# EAGLE design HC-BME280_revA (EAGLE 7.3.0)
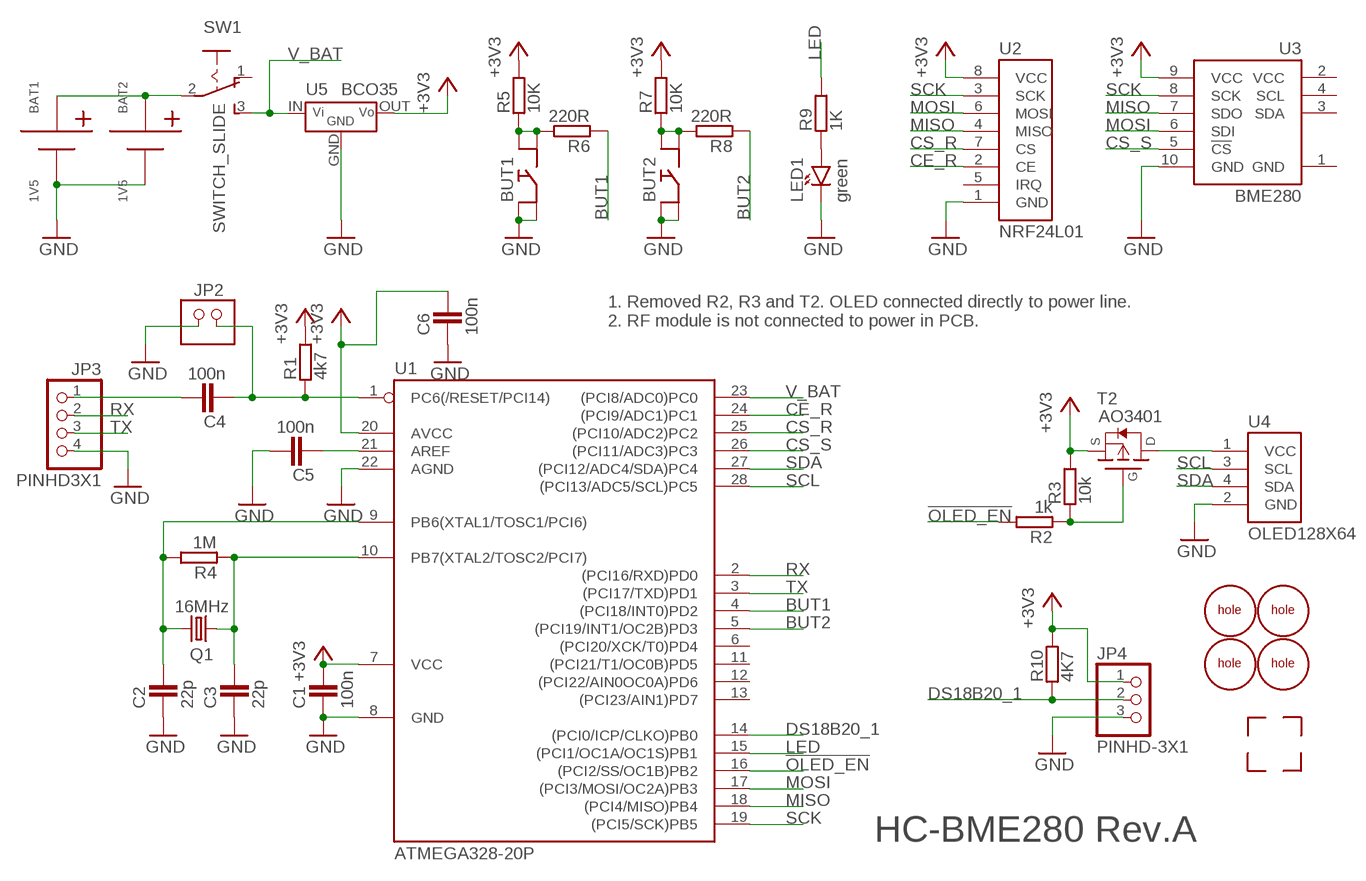
[diagram p0: schematic, sheet 1]

## Parts
BAT1  1V5  BATTERY_1X  [1XAA_BATTERY_HOLDER]
BAT2  1V5  BATTERY_1X  [1XAA_BATTERY_HOLDER]
BUT1  BUTTON'THT'  [BUTTON]
BUT2  BUTTON'THT'  [BUTTON]
C1  100n  C-CERAMIC'SMD'  [C0805]
C2  22p  C-CERAMIC'SMD'  [C0805]
C3  22p  C-CERAMIC'SMD'  [C0805]
C4  100n  C-CERAMIC'SMD'  [C0805]
C5  100n  C-CERAMIC'SMD'  [C0805]
C6  100n  C-CERAMIC'SMD'  [C0805]
JP2  PINHD2X1  PINHD-2X1  [PINHD-2X1]
JP3  PINHD3X1  PINHD-4X1  [PINHD-4X1-90]
JP4  PINHD-3X1  [PINHD-3X1]
LED1  green  LED'SMD'  [LED0805]
Q1  16MHz  CRYSTALHC49S  [HC49/S]
R1  4k7  R'2'  [R0805]
R2  1k  R'2'  [R0805]
R3  10k  R'2'  [R0805]
R4  1M  R'2'  [R0805]
R5  10K  R'2'  [R0805]
R6  220R  R'2'  [R0805]
R7  10K  R'2'  [R0805]
R8  220R  R'2'  [R0805]
R9  1K  R'2'  [R0805]
R10  4K7  R'2'  [R0805]
SW1  SWITCH_SLIDE  [SLIDE_SWITCH]
T2  AO3401  [SOT23]
U1  ATMEGA328-20P  [DIL28-3]
U2  NRF24L01  [NRF24L01]
U3  BME280  [BME280]
U4  OLED128X64  [OLED128X64]
U5  BCO35  STEP_UP-BCO35  [BCO35]
U$1  CORNER  [CORNER]
U$2  CORNER  [CORNER]
U$3  CORNER  [CORNER]
U$4  CORNER  [CORNER]
U$5  HOLE  [HOLE]
U$6  HOLE  [HOLE]
U$7  HOLE  [HOLE]
U$8  HOLE  [HOLE]

## Nets
!OLED_EN: R2.2 U1.16((PCI2/SS/OC1B)PB2)
+3V3: C1.2 C6.2 JP4.1 R1.2 R3.2 R5.2 R7.2 R10.2 T2.2(S) U1.7(VCC) U1.20(AVCC) U2.8(VCC) U3.9(VCC) U5.OUT(VOUT)
BUT1: R6.1 U1.4((PCI18/INT0)PD2)
BUT2: R8.1 U1.5((PCI19/INT1/OC2B)PD3)
CE_R: U1.24((PCI9/ADC1)PC1) U2.2(CE)
CS_R: U1.25((PCI10/ADC2)PC2) U2.7(CS)
CS_S: U1.26((PCI11/ADC3)PC3) U3.5(!CS)
DS18B20_1: JP4.2 R10.1 U1.14((PCI0/ICP/CLKO)PB0)
GND: BAT1.N BAT2.N BUT1.2 BUT1.4 BUT2.2 BUT2.4 C1.1 C2.1 C3.1 C5.2 C6.1 JP2.1 JP3.4 JP4.3 LED1.2(K) U1.8(GND) U1.22(AGND) U2.1(GND) U3.10(GND) U4.2(GND) U5.GND
LED: R9.2 U1.15((PCI1/OC1A/OC1S)PB1)
MISO: U1.18((PCI4/MISO)PB4) U2.4(MISO) U3.7(SDO)
MOSI: U1.17((PCI3/MOSI/OC2A)PB3) U2.6(MOSI) U3.6(SDI)
N$1: C3.2 Q1.1 R4.1 U1.10(PB7(XTAL2/TOSC2/PCI7))
N$2: C4.1 JP2.2 R1.1 U1.1(PC6(/RESET/PCI14))
N$3: R2.1 R3.1 T2.1(G)
N$4: C2.2 Q1.2 R4.2 U1.9(PB6(XTAL1/TOSC1/PCI6))
N$5: C5.1 U1.21(AREF)
N$6: C4.2 JP3.1
N$7: T2.3(D) U4.1(VCC)
N$8: BAT1.P BAT2.P SW1.2(MIDDLE)
N$9: BUT1.1 BUT1.3 R5.1 R6.2
N$10: BUT2.1 BUT2.3 R7.1 R8.2
N$11: LED1.1(A) R9.1
RX: JP3.2 U1.2((PCI16/RXD)PD0)
SCK: U1.19((PCI5/SCK)PB5) U2.3(SCK) U3.8(SCK)
SCL: U1.28((PCI13/ADC5/SCL)PC5) U4.3(SCL)
SDA: U1.27((PCI12/ADC4/SDA)PC4) U4.4(SDA)
TX: JP3.3 U1.3((PCI17/TXD)PD1)
V_BAT: SW1.3(S) U1.23((PCI8/ADC0)PC0) U5.IN(VIN)
Unconnected: SW1.1(O) U1.6((PCI20/XCK/T0)PD4) U1.11((PCI21/T1/OC0B)PD5) U1.12((PCI22/AIN0OC0A)PD6) U1.13((PCI23/AIN1)PD7) U2.5(IRQ) U3.3(SDA) U3.4(SCL)

## Notes on the sheet
- 1. Removed R2, R3 and T2. OLED connected directly to power line.
  2. RF module is not connected to power in PCB.
- HC-BME280 Rev.A

## Power pins joined to a net without a drawn wire
GND: U3.1(GND)
VCC: U3.2(VCC)

## Library data of the parts
BAT1 BAT2 = 1_domaci:BATTERY_1X
BUT1 BUT2 = 1_domaci:BUTTON
C1-C6 = 1_domaci:C-CERAMIC
JP2 = 1_domaci:PINHD-2X1
JP3 = 1_domaci:PINHD-4X1: PIN HEADER
JP4 = 1_domaci:PINHD-3X1
LED1 = 1_domaci:LED
Q1 = crystal:CRYSTAL: CRYSTAL; OC_FARNELL: 1667008; OC_NEWARK: unknown
R1-R10 = 1_domaci:R
SW1 = 1_domaci:SWITCH_SLIDE
T2 = 1_domaci:AO3401
U1 = 1_domaci:ATMEGA328*P: MICROCONTROLLER 32 kBytes FLASH 2 kBytes SRAM 1 kBytes EEPROM USART 8-channel 10 bit ADC
U2 = 1_domaci:NRF24L01
U3 = 1_domaci:BME280
U4 = 1_domaci:OLED128X64
U5 = 1_domaci:STEP_UP-BCO35
U$1-U$4 = 1_domaci:CORNER
U$5-U$8 = 1_domaci:HOLE

## Board
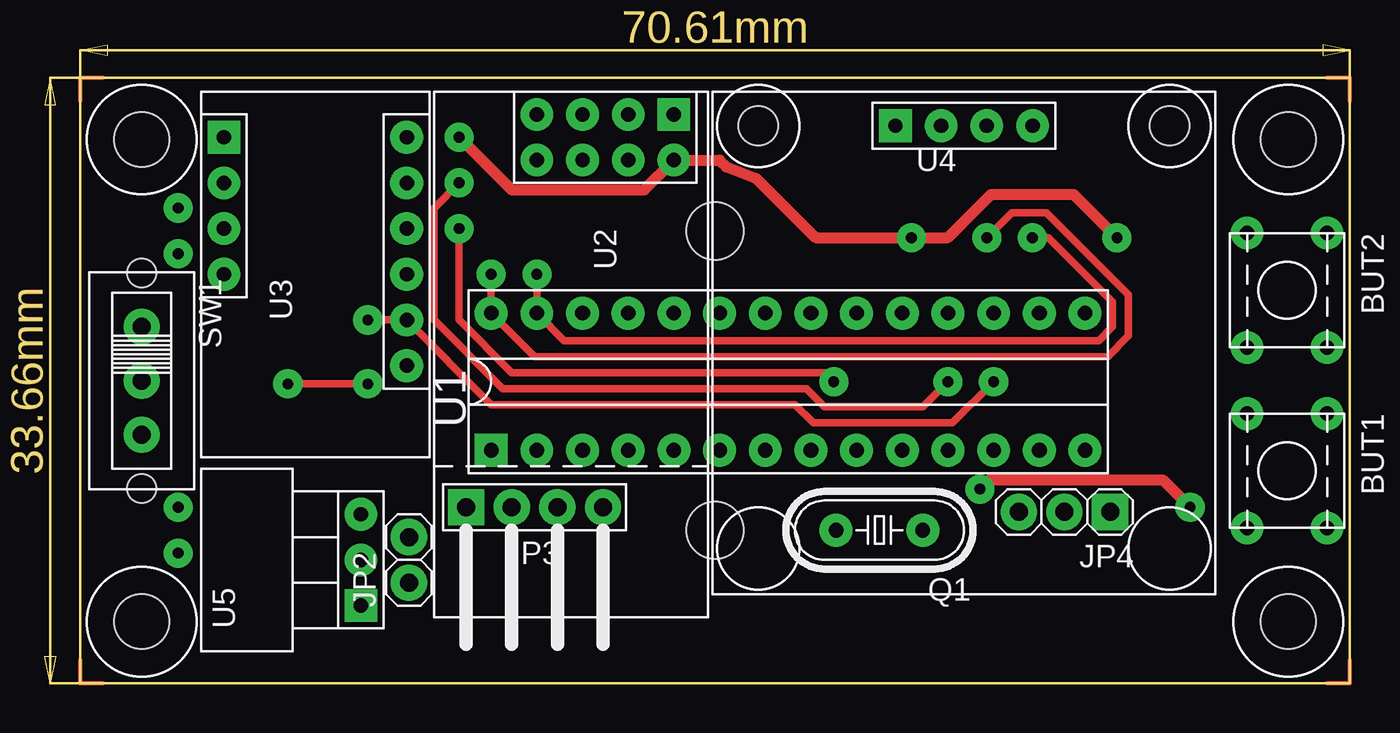
[diagram p1: board, top side]
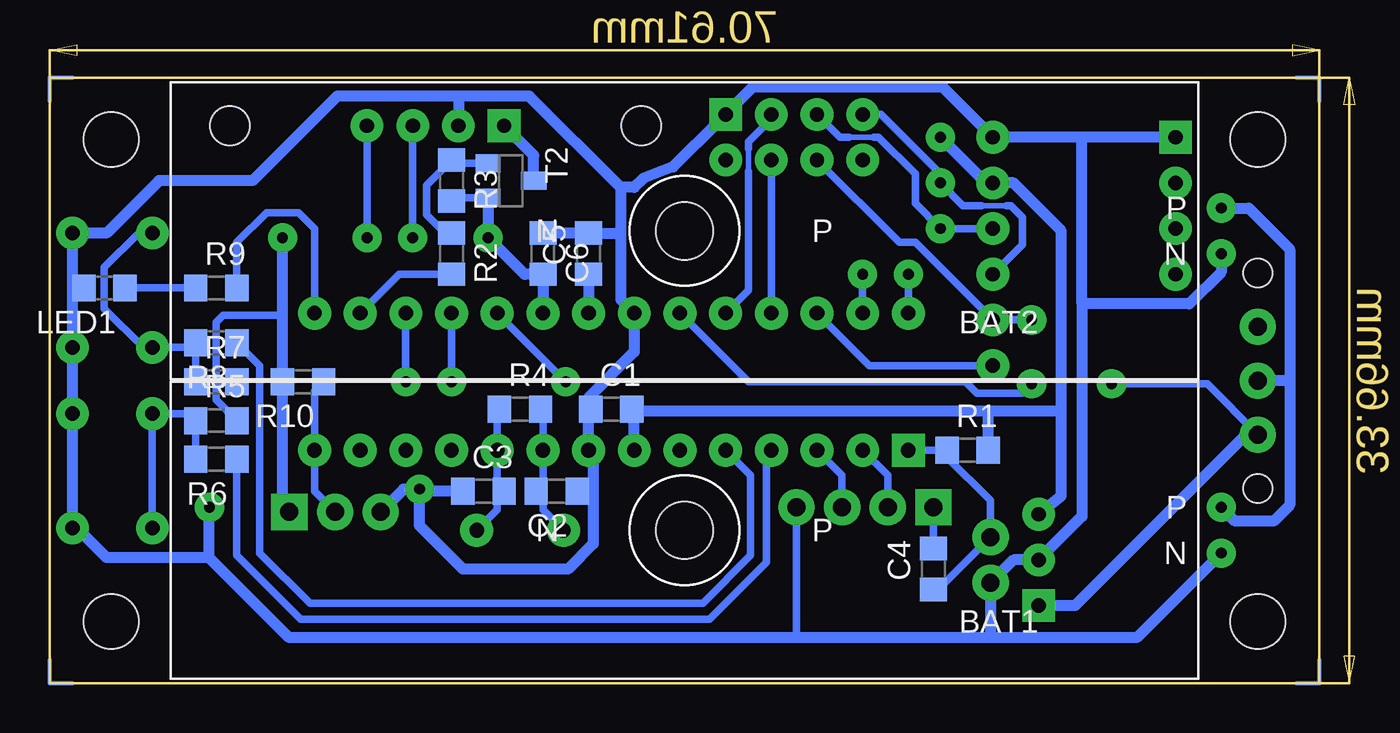
[diagram p2: board, bottom side, seen from below]

Size 70.61 x 33.66 mm. Coordinates in mm from the lower left corner, seen from the top.
Outline: 0,33.66 70.61,33.66 70.61,0 0,0 0,33.66
Copper layers (1*16): Top 0.035mm / dielectric 1.5mm / Bottom 0.035mm
Design rules "default *": minimum track width 10mil, minimum drill 24mil, track to track 8mil, track to pad 8mil, pad to pad 8mil, via to via 8mil, smd to smd 8mil, copper to edge 40mil, drill to drill 8mil, minimum pad ring 20mil, minimum via ring 20mil, stop-mask expansion 4mil, vias tented up to drill 0mil, thermal gap 10mil

### Footprints (pad centres in the part's own frame; a part is rotated, then mirrored left to right if it is on the bottom)
1XAA_BATTERY_HOLDER = drill 0.6: N -29.845,1.27; P -29.845,-1.27 | hole 3.2: 0,0
BUTTON = drill 0.8 pad 1.676: 1 -2.54,-2.54; 2 -2.54,1.905; 3 3.81,-2.54; 4 3.81,1.905
C0805 = smd 1.3 x 1.5: 1 -1.143,0; 2 1.143,0
PINHD-2X1 = drill 1 pad 1.676: 1 -1.27,0; 2 1.27,0
PINHD-4X1-90 = drill 1 pad 1.854 square: 1 3.81,0 | drill 1 pad 1.854: 2 1.27,0; 3 -1.27,0; 4 -3.81,0
PINHD-3X1 = drill 1 pad 1.676 square: 1 -2.54,0 | drill 1 pad 1.676: 2 0,0; 3 2.54,0
LED0805 = smd 1.3 x 1.5: 1 -1.143,0; 2 1.143,0
HC49/S = drill 0.813: 1 -2.413,0; 2 2.413,0
R0805 = smd 1.3 x 1.5: 1 -1.143,0; 2 1.143,0
SLIDE_SWITCH = drill 1 pad 1.93: 1 -2.921,0; 2 0.076,0; 3 3.073,0 | hole 1.6: 6.071,0; -5.918,0
SOT23 = smd 1 x 1.4: 1 -0.953,-1.27; 2 0.953,-1.27; 3 0,1.27
DIL28-3 = drill 0.813 square: 1 -16.51,-3.81 | drill 0.813: 2 -13.97,-3.81; 3 -11.43,-3.81; 4 -8.89,-3.81; 5 -6.35,-3.81; 6 -3.81,-3.81; 7 -1.27,-3.81; 8 1.27,-3.81; 9 3.81,-3.81; 10 6.35,-3.81; 11 8.89,-3.81; 12 11.43,-3.81; 13 13.97,-3.81; 14 16.51,-3.81; 15 16.51,3.81; 16 13.97,3.81; 17 11.43,3.81; 18 8.89,3.81; 19 6.35,3.81; 20 3.81,3.81; 21 1.27,3.81; 22 -1.27,3.81; 23 -3.81,3.81; 24 -6.35,3.81; 25 -8.89,3.81; 26 -11.43,3.81; 27 -13.97,3.81; 28 -16.51,3.81
NRF24L01 = drill 0.8 square: 1 -1.27,5.08 | drill 0.8: 2 -1.27,2.54; 3 -1.27,0; 4 -1.27,-2.54; 5 1.27,-2.54; 6 1.27,0; 7 1.27,2.54; 8 1.27,5.08
BME280 = drill 0.8 square: 1 -5.08,7.62 | drill 0.8: 2 -5.08,5.08; 3 -5.08,2.54; 4 -5.08,0; 5 5.08,-5.08; 6 5.08,-2.54; 7 5.08,0; 8 5.08,2.54; 9 5.08,5.08; 10 5.08,7.62
OLED128X64 = drill 0.8 square: 1 -3.81,0 | drill 0.8: 2 -1.27,0; 3 1.27,0; 4 3.81,0 | hole 2.2: -11.43,0; 11.43,0
BCO35 = drill 0.8: GND 0,0; OUT 2.54,0 | drill 0.8 square: IN -2.54,0
HOLE = hole 3.048: 0,0

### Placement (x,y rotation side)
BAT1  35.31,8.51 180 bottom
BAT2  35.31,25.15 180 bottom
BUT1  67.44,12.45 270 top
BUT2  67.44,22.48 270 top
C1  39.37,15.24 0 bottom
C2  42.42,10.67 180 bottom
C3  46.48,10.67 0 bottom
C4  21.46,6.35 90 bottom
C5  40.64,23.88 90 bottom
C6  43.18,23.88 270 bottom
JP2  18.29,6.86 90 top
JP3  25.27,9.78 180 top
JP4  54.74,9.53 180 top
LED1  67.56,21.97 180 bottom
Q1  44.45,8.51 180 top
R1  19.56,12.95 0 bottom
R2  48.26,23.88 270 bottom
R3  48.26,27.94 270 bottom
R4  44.45,15.24 0 bottom
R5  61.34,14.61 0 bottom
R6  61.34,12.45 180 bottom
R7  61.34,16.76 0 bottom
R8  61.34,18.92 180 bottom
R9  61.34,21.97 0 bottom
R10  56.52,16.76 180 bottom
SW1  3.43,16.89 270 top
T2  44.96,27.94 270 bottom
U1  39.37,16.76 0 top
U2  27.94,30.35 270 top
U3  13.08,22.73 0 top
U4  49.15,30.99 0 top
U5  15.62,6.86 90 top
U$1  69.98,33.02 180 top
U$2  0.64,0.64 0 top
U$3  0.64,33.02 270 top
U$4  69.98,0.64 90 top
U$5  67.18,3.43 90 top
U$6  67.18,30.23 90 top
U$7  3.43,30.23 90 top
U$8  3.43,3.43 90 top

### Tracks (layer width: path | path; a pad name or v marks a point on that pad's centre or on a via)
!OLED_EN
  Bottom 0.406: U1.16 51.18,22.73 R2.2
+3V3  (via drill 0.6)
  Top 0.61: v57.66,24.77 55.24,27.18 50.67,27.18 48.26,24.77 v46.23,24.77 40.89,24.77 37.59,28.07 35.94,28.7 35.56,29.08 U2.8 31.37,27.43 24,27.43 v21.08,30.35
  Bottom 0.406: 61.34,16.76 61.34,15.75 R5.2 | R7.2 61.34,16.76 | T2.2 48.07,26.99 R3.2 | 61.34,16.76 61.34,20.07 60.96,20.45 57.66,20.45
  Bottom 0.61: U1.20 C6.2 44.2,22.73 v46.23,24.77 T2.2 | JP4.1 57.66,9.91 R10.2 57.66,20.45 v57.66,24.77 | U1.7 38.1,15.11 | v21.08,30.35 18.54,27.81 U3.9 17.02,27.81 14.35,25.15 14.35,15.11 | 14.35,15.11 18.41,15.11 | 18.41,15.11 38.1,15.11 | 38.1,15.11 C1.2 | R1.2 18.41,15.11 | U5.OUT 14.35,10.41 14.35,15.11
BUT1
  Bottom 0.406: U1.4 30.73,12.7 30.73,6.73 33.91,3.56 56.64,3.56 60.2,7.11 R6.1 60.2,12.06
BUT2
  Bottom 0.406: U1.5 31.62,11.56 31.62,7.11 34.29,4.45 56.13,4.45 58.93,7.24 58.93,17.65 R8.1
CE_R
  Bottom 0.305: 31.75,29.72 31.75,28.45
  Bottom 0.406: U2.2 30.48,31.37 31.75,30.1 31.75,29.72 | U1.24 31.75,21.84 31.75,28.45
CS_R
  Bottom 0.406: U2.7 U1.25
CS_S
  Bottom 0.406: U1.26 25.02,17.65 U3.5 18.03,17.65
DS18B20_1
  Bottom 0.406: R10.1 55.88,16.26 U1.14 55.88,10.67 JP4.2
GND  (via drill 0.6)
  Top 0.61: v50.04,10.79 50.55,11.3 60.2,11.3 v61.72,9.78
  Bottom 0.406: LED1.2 69.34,21.97 | C2.1 40.39,10.67 | JP3.4 29.08,2.54
  Bottom 0.61: 38.86,27.56 38.1,27.56 37.59,28.07 35.94,28.7 33.4,31.24 33.4,31.62 U2.1 31.5,33.15 20.95,33.15 U3.10 13.21,30.35 | 38.86,27.56 43.94,32.64 47.88,32.64 | 47.88,32.64 U4.2 | 47.88,32.64 54.61,32.64 59.31,27.94 64.52,27.94 67.44,25.02 BUT2.2 69.34,21.97 BUT2.4 BUT1.2 BUT1.4 68.71,8.26 67.44,6.99 61.72,6.99 | C1.1 40.64,14.99 U1.8 40.39,12.7 40.39,10.67 40.39,7.75 41.78,6.35 47.62,6.35 50.04,8.76 v50.04,10.79 | 38.86,27.56 38.86,24.89 | 38.86,24.89 38.86,21.34 U1.22 38.1,18.41 40.64,15.88 40.64,15.24 | 38.86,24.89 38.99,25.02 C5.2 C6.1 | U3.1 13.21,30.35 | 13.21,21.08 7.24,21.08 5.46,22.86 BAT2.N | 18.29,2.54 29.08,2.54 57.28,2.54 61.72,6.99 | 13.21,21.08 13.21,30.35 | BAT1.N 10.16,2.54 18.29,2.54 | 13.21,21.08 13.21,9.27 U5.GND 17.02,6.86 JP2.1 18.29,2.54 | C3.1 49.91,10.67 v50.04,10.79 | v50.04,10.79 50.93,10.79 JP4.3 | 61.72,6.99 v61.72,9.78
LED
  Bottom 0.406: U1.15 55.88,25.27 56.77,26.16 58.55,26.16 60.2,24.51 R9.2
MISO  (via drill 0.6)
  Top 0.406: v48.26,16.76 46.86,15.37 41.4,15.37 40.39,16.38 23.5,16.38 19.68,20.19 19.68,26.42 v21.08,27.81
  Bottom 0.305: 17.4,26.54 18.8,26.54
  Bottom 0.406: U3.7 16.51,24.38 16.51,25.91 17.14,26.54 17.4,26.54 | U1.18 v48.26,16.76 | U2.4 24.38,31.62 21.08,28.32 v21.08,27.81 19.81,26.54 18.8,26.54
MOSI  (via drill 0.6)
  Top 0.406: v50.8,16.76 48.51,14.48 40.77,14.48 39.75,15.49 22.86,15.49 U3.6 v16,20.19
  Bottom 0.406: U1.17 v50.8,16.76 | v16,20.19 U3.6 22.48,24.51 23.37,24.51 U2.6
N$1
  Bottom 0.406: R4.1 45.72,15.11 U1.10 45.72,11.05 C3.2 45.34,10.54 45.72,10.16 45.72,9.65 Q1.1
N$2
  Bottom 0.406: U1.1 R1.1 20.7,12.57 18.29,10.16 JP2.2 21.21,5.21 C4.1 21.08,5.59
N$3
  Bottom 0.406: R2.1 48.77,25.15 49.66,26.04 49.66,27.69 R3.1 48.07,28.89 T2.1
N$4
  Bottom 0.406: R4.2 43.18,15.11 U1.9 43.18,11.05 C2.2 43.56,10.54 43.18,10.16 43.18,9.65 Q1.2
N$5
  Bottom 0.61: C5.1 U1.21
N$6
  Bottom 0.406: JP3.1 C4.2
N$7
  Bottom 0.61: T2.3 43.69,29.34 U4.1
N$8
  Bottom 0.61: 1.65,16.76 1.65,9.91 2.54,9.02 4.7,9.02 BAT1.P | 1.65,16.76 1.65,24.13 3.94,26.42 BAT2.P | 1.65,16.76 1.7,16.82 SW1.2
N$9
  Bottom 0.406: BUT1.3 BUT1.1 62.74,14.99 R5.1 R6.2
N$10
  Bottom 0.406: R7.1 R8.2 62.74,18.67 BUT2.3 65.41,18.67 67.56,20.83 67.56,23.11 65.66,25.02 BUT2.1
N$11
  Bottom 0.406: R9.1 LED1.1
RX
  Bottom 0.406: U1.2 24,11.56 JP3.2
SCK  (via drill 0.6)
  Top 0.406: v41.91,16.76 41.53,17.27 24,17.27 21.08,20.19 v21.08,25.27
  Bottom 0.305: 24.77,30.35 26.16,30.35
  Bottom 0.406: U2.3 26.67,30.35 26.16,30.35 | U1.19 v41.91,16.76 | U3.8 v21.08,25.27 22.48,26.67 22.48,28.32 24.51,30.35 24.77,30.35
SCL  (via drill 0.6)
  Top 0.406: v22.86,22.73 U1.28 25.27,18.16 57.15,18.16 58.29,19.3 58.29,21.59 53.72,26.16 51.82,26.16 v50.42,24.77
  Bottom 0.406: v22.86,22.73 U1.28 | v50.42,24.77 U4.3
SDA  (via drill 0.6)
  Top 0.406: v25.4,22.73 U1.27 26.92,19.05 56.64,19.05 57.4,19.81 57.4,21.21 53.85,24.77 v52.96,24.77
  Bottom 0.406: v25.4,22.73 U1.27 | v52.96,24.77 U4.4
TX
  Bottom 0.406: U1.3 26.54,11.56 JP3.3
V_BAT  (via drill 0.6)
  Top 0.406: v11.56,16.64 v16,16.64
  Bottom 0.406: U1.23 31.75,16.76 19.68,16.76 19.05,16.13 16.51,16.13 v16,16.64 | SW1.3 6.25,16.64 v11.56,16.64
  Bottom 0.61: SW1.3 4.09,13.82 13.59,4.32 U5.IN